# EAGLE design Zusatzprint_Raspberry_Pi_Zero (EAGLE 9.0.1)
DESIGNER: HOSA; VER: 1
Assembly variants: Standardbestückung, ohne HMI Channel 2, ohne HMI

## Sheet 1 of 3
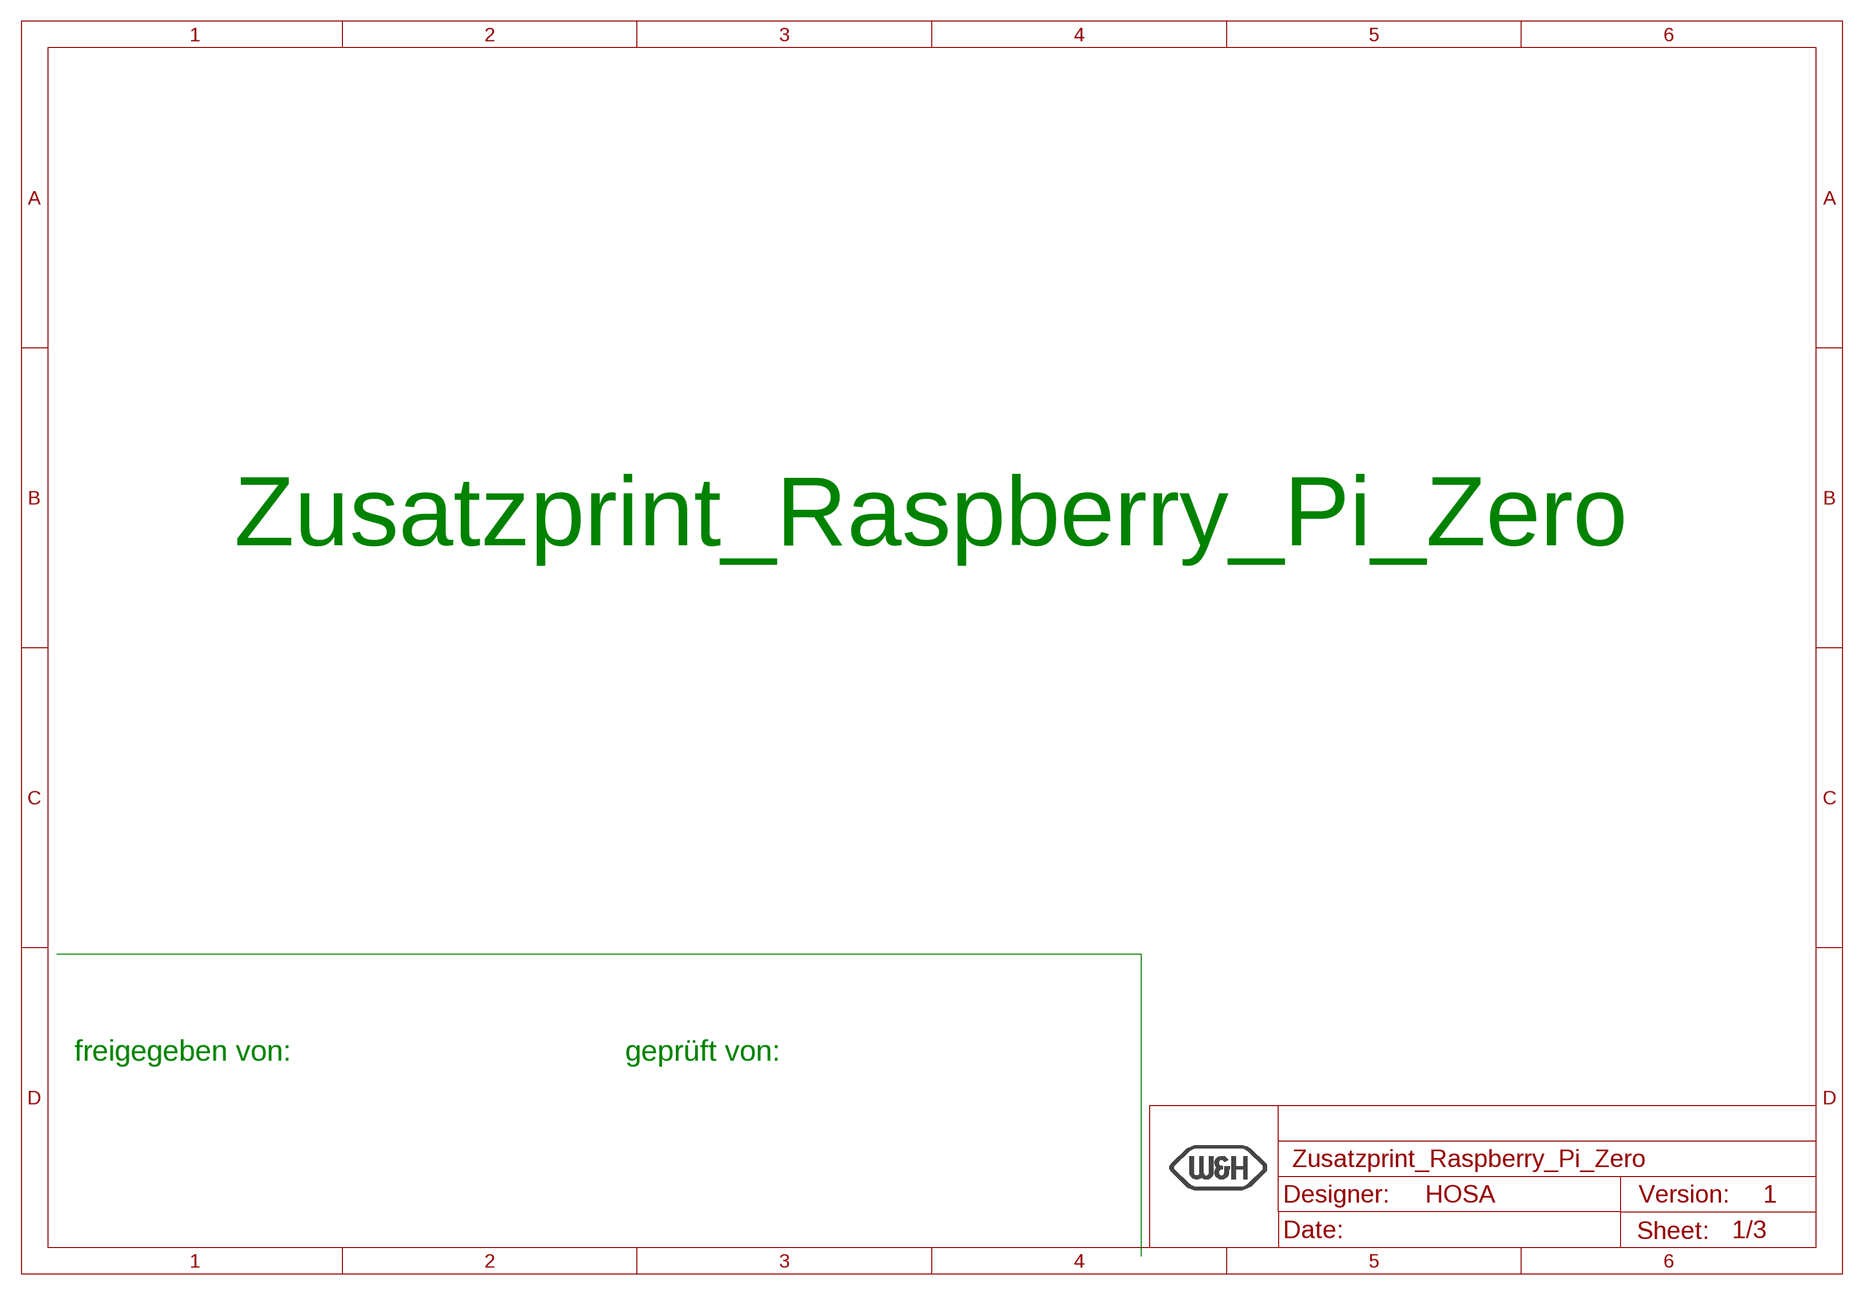
[diagram p0: schematic, sheet 1]
F1 (A4-QUERFORMAT): DESIGNER: HOSA; VER: 1

### Notes on the sheet
- Zusatzprint_Raspberry_Pi_Zero
- freigegeben von: | geprüft von:

## Sheet 2 of 3
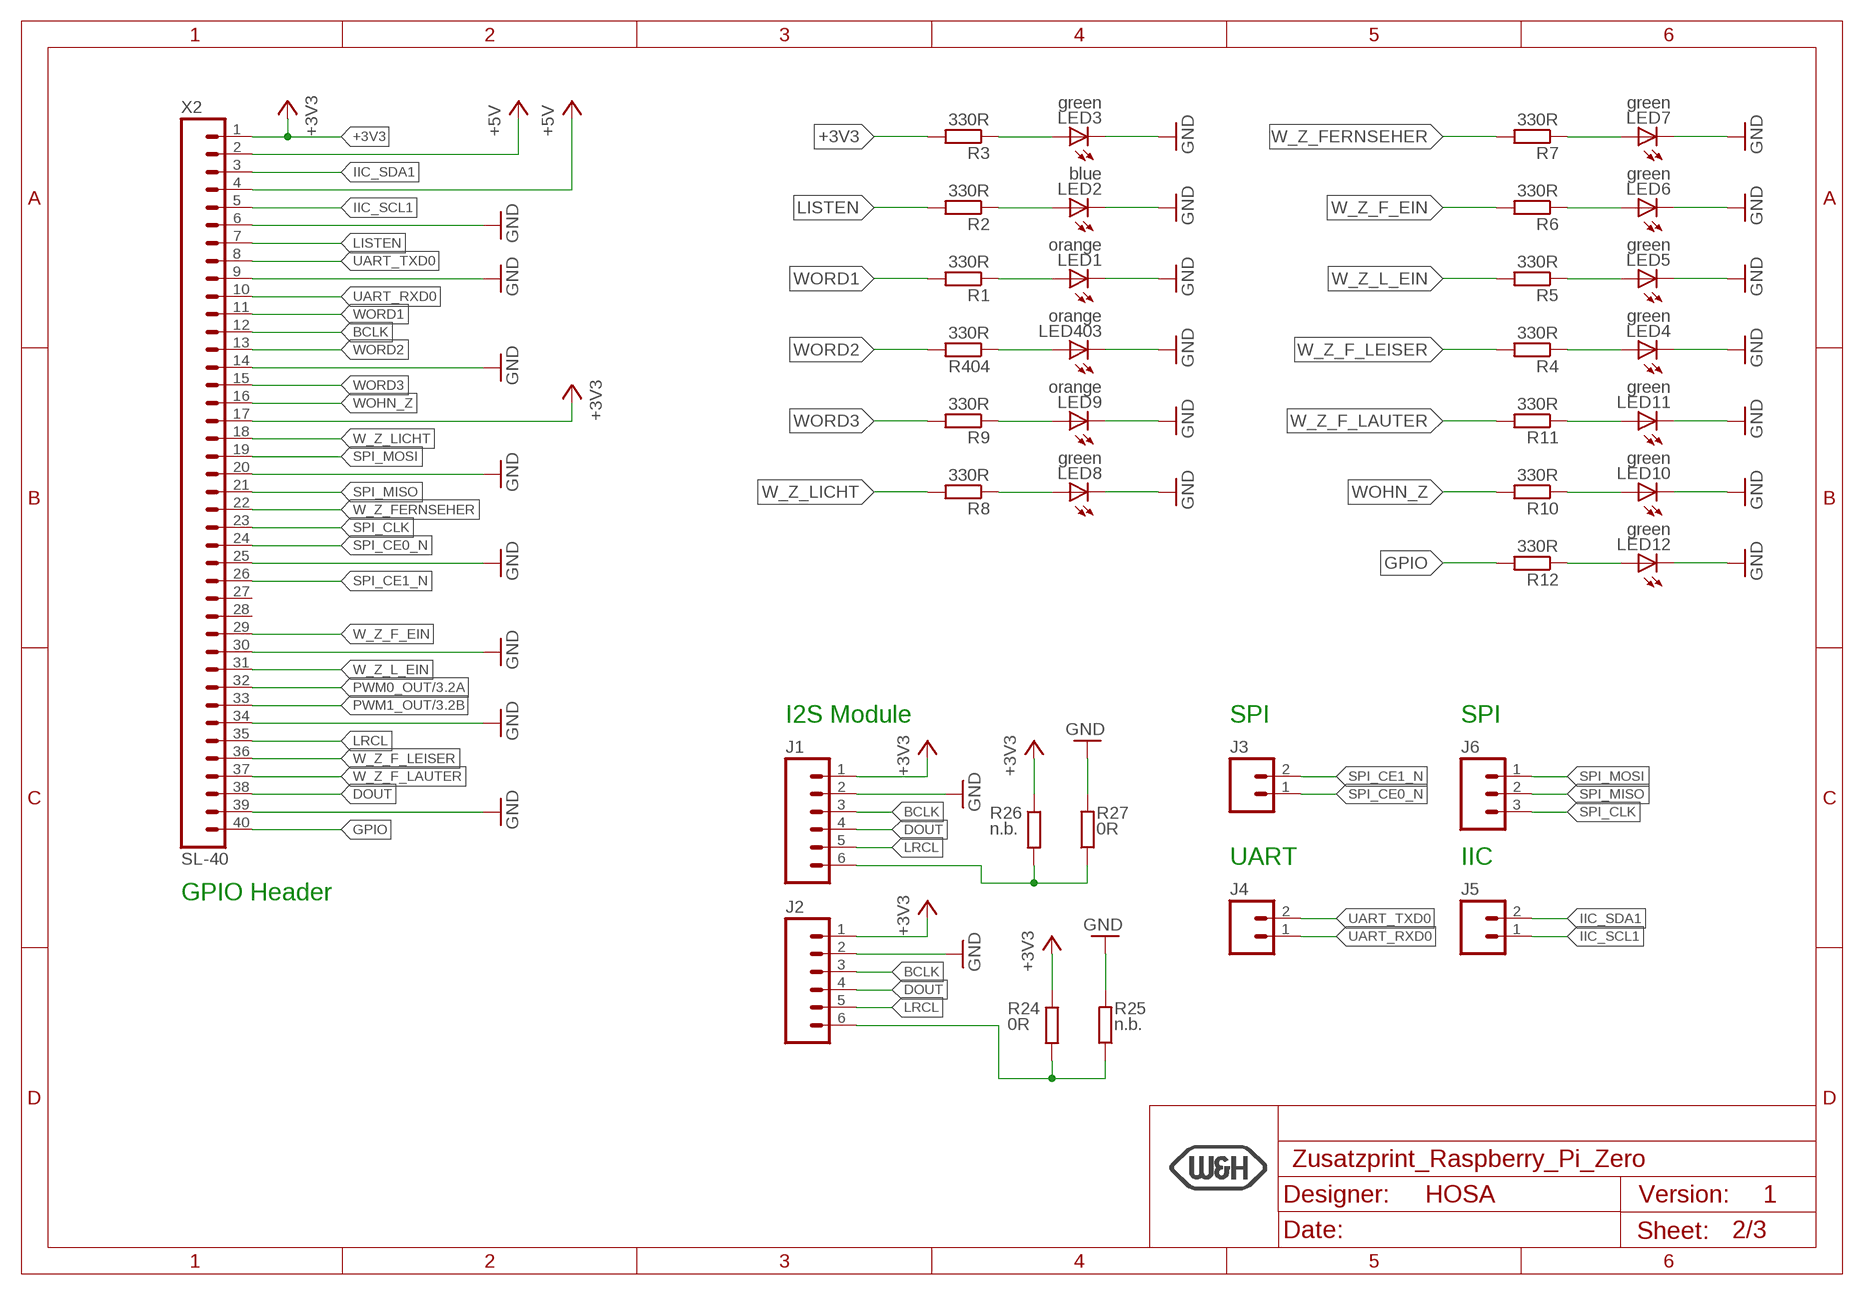
[diagram p1: schematic, sheet 2]
F2 (A4-QUERFORMAT): DESIGNER: HOSA; VER: 1

### Parts
J1  S-LEISTE-06  [BL-06]
J2  S-LEISTE-06  [BL-06]
J3  S-LEISTE-02  [BL-02]
J4  S-LEISTE-02  [BL-02]
J5  S-LEISTE-02  [BL-02]
J6  S-LEISTE-03  [BL-03]
LED1  orange  LEDCHIP-LED0805  [CHIP-LED0805]
LED2  blue  LEDCHIP-LED0805  [CHIP-LED0805]
LED3  green  LEDCHIP-LED0805  [CHIP-LED0805]
LED4  green  LEDCHIP-LED0805  [CHIP-LED0805]
LED5  green  LEDCHIP-LED0805  [CHIP-LED0805]
LED6  green  LEDCHIP-LED0805  [CHIP-LED0805]
LED7  green  LEDCHIP-LED0805  [CHIP-LED0805]
LED8  green  LEDCHIP-LED0805  [CHIP-LED0805]
LED9  orange  LEDCHIP-LED0805  [CHIP-LED0805]
LED10  green  LEDCHIP-LED0805  [CHIP-LED0805]
LED11  green  LEDCHIP-LED0805  [CHIP-LED0805]
LED12  green  LEDCHIP-LED0805  [CHIP-LED0805]
LED403  orange  LEDCHIP-LED0805  [CHIP-LED0805]
R1  330R  R-EU_M0805  [M0805]
R2  330R  R-EU_M0805  [M0805]
R3  330R  R-EU_M0805  [M0805]
R4  330R  R-EU_M0805  [M0805]
R5  330R  R-EU_M0805  [M0805]
R6  330R  R-EU_M0805  [M0805]
R7  330R  R-EU_M0805  [M0805]
R8  330R  R-EU_M0805  [M0805]
R9  330R  R-EU_M0805  [M0805]
R10  330R  R-EU_M0805  [M0805]
R11  330R  R-EU_M0805  [M0805]
R12  330R  R-EU_M0805  [M0805]
R24  0R  R-EU_M0805  [M0805]
R25  n.b.  R-EU_M0805  [M0805]
R26  n.b.  R-EU_M0805  [M0805]
R27  0R  R-EU_M0805  [M0805]
R404  330R  R-EU_M0805  [M0805]
X2  SL-40  [SL_40]

### Nets
+3V3: J1.1 J2.1 R3.2 R24.1 R26.1 X2.1 X2.17 ; also sheet 3
+5V: X2.2 X2.4
BCLK: J1.3 J2.3 X2.12
DOUT: J1.4 J2.4 X2.38
GND: J1.2 J2.2 LED1.C LED2.C LED3.C LED4.C LED5.C LED6.C LED7.C LED8.C LED9.C LED10.C LED11.C LED12.C LED403.C R25.2 R27.2 X2.6 X2.9 X2.14 X2.20 X2.25 X2.30 X2.34 X2.39 ; also sheet 3
GPIO: R12.2 X2.40
IIC_SCL1: J5.1 X2.5
IIC_SDA1: J5.2 X2.3
LISTEN: R2.2 X2.7
LRCL: J1.5 J2.5 X2.35
N$2: LED1.A R1.1
N$3: LED2.A R2.1
N$4: LED3.A R3.1
N$5: LED12.A R12.1
N$13: J2.6 R24.2 R25.1
N$15: J1.6 R26.2 R27.1
N$24: LED4.A R4.1
N$25: LED5.A R5.1
N$26: LED6.A R6.1
N$27: LED7.A R7.1
N$30: LED8.A R8.1
N$31: LED9.A R9.1
N$32: LED10.A R10.1
N$33: LED11.A R11.1
N$35: LED403.A R404.1
PWM0_OUT: X2.32 ; also sheet 3
PWM1_OUT: X2.33 ; also sheet 3
SPI_CE0_N: J3.1 X2.24
SPI_CE1_N: J3.2 X2.26
SPI_CLK: J6.3 X2.23
SPI_MISO: J6.2 X2.21
SPI_MOSI: J6.1 X2.19
UART_RXD0: J4.1 X2.10
UART_TXD0: J4.2 X2.8
W_Z_F_EIN: R6.2 X2.29
W_Z_F_LAUTER: R11.2 X2.37
W_Z_F_LEISER: R4.2 X2.36
W_Z_FERNSEHER: R7.2 X2.22
W_Z_L_EIN: R5.2 X2.31
W_Z_LICHT: R8.2 X2.18
WOHN_Z: R10.2 X2.16
WORD1: R1.2 X2.11
WORD2: R404.2 X2.13
WORD3: R9.2 X2.15
Unconnected: X2.27 X2.28

### Notes on the sheet
- I2S Module | SPI | SPI
- UART | IIC
- GPIO Header

## Sheet 3 of 3
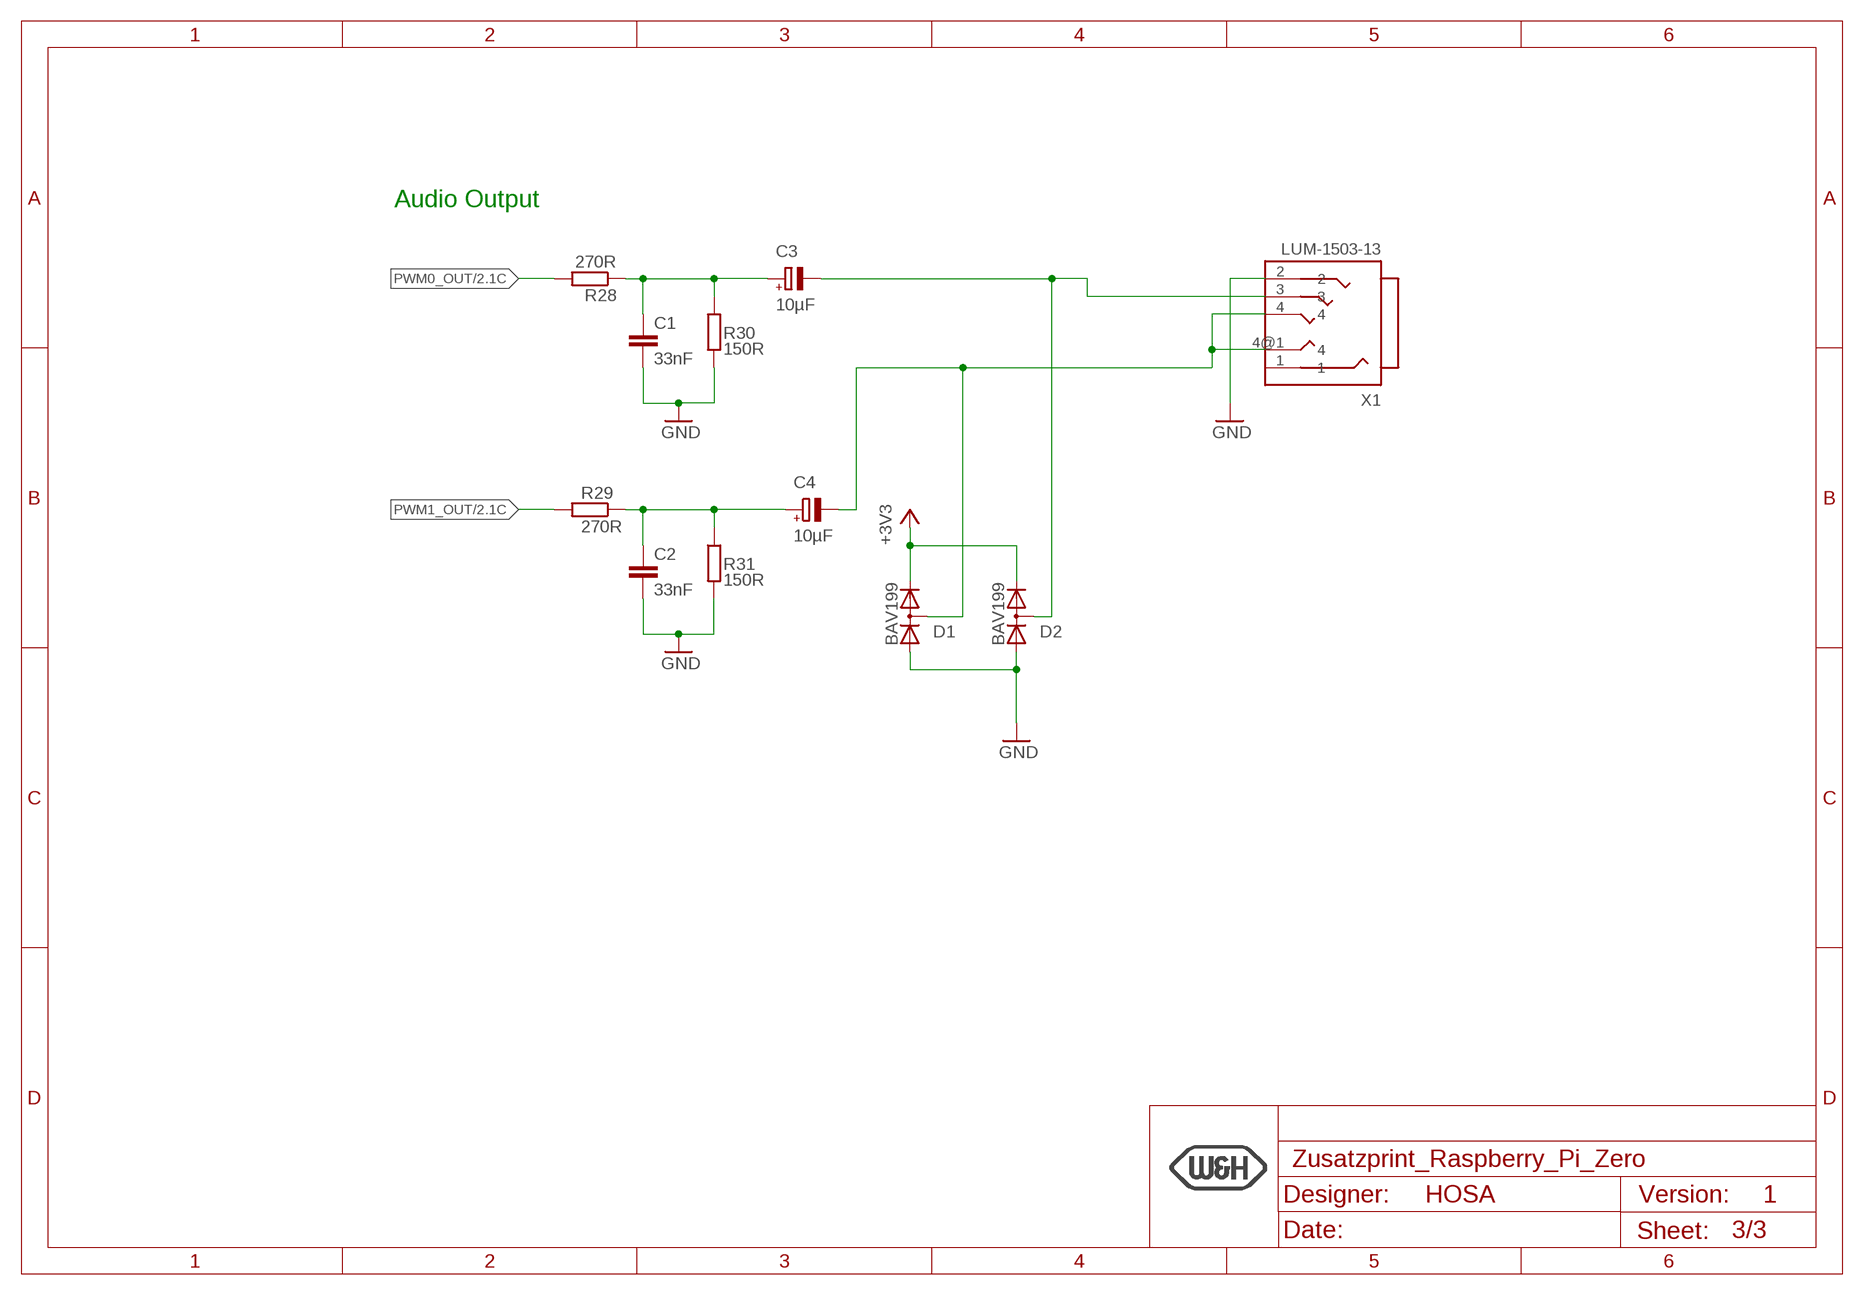
[diagram p2: schematic, sheet 3]
F3 (A4-QUERFORMAT): DESIGNER: HOSA; VER: 1

### Parts
C1  33nF  C-EUC0805  [C0805]
C2  33nF  C-EUC0805  [C0805]
C3  10µF  CPOL-EUE2.5-6  [E2,5-6]
C4  10µF  CPOL-EUE2.5-6  [E2,5-6]
D1  BAV199  [SOT23]
D2  BAV199  [SOT23]
R28  270R  R-EU_M0805  [M0805]
R29  270R  R-EU_M0805  [M0805]
R30  150R  R-EU_M0805  [M0805]
R31  150R  R-EU_M0805  [M0805]
X1  LUM-1503-13  [1503-13]

### Nets
+3V3: D1.2(C) D2.2(C) ; also sheet 2
GND: C1.2 C2.2 D1.1(A) D2.1(A) R30.2 R31.2 X1.2 ; also sheet 2
N$22: C1.1 C3.+ R28.1 R30.1
N$67: C2.1 C4.+ R29.1 R31.1
N$71: C4.- D1.3(AC) X1.4 X1.4@1
N$74: C3.- D2.3(AC) X1.3
PWM0_OUT: R28.2 ; also sheet 2
PWM1_OUT: R29.2 ; also sheet 2
Unconnected: X1.1

### Notes on the sheet
- Audio Output

## Library data of the parts
C1 C2 = rcl:C-EU: CAPACITOR, European symbol
C3 C4 = rcl:CPOL-EU: POLARIZED CAPACITOR, European symbol
D1 D2 = diode:BAV199: DIODE low-leakage double diode
J1 J2 = user_connector:*-LEISTE-06: Connector ; Stiftleilste 6 polig ; grid 2,54 mm
J3-J5 = user_connector:*-LEISTE-02: Connector ; Stiftleilste 2 polig ; grid 2,54 mm
J6 = user_connector:*-LEISTE-03: Connector ; Stiftleilste 3 polig ; grid 2,54 mm
LED1-LED12 LED403 = led:LED: LED OSRAM: - CHIPLED LG R971, LG N971, LY N971, LG Q971, LY Q971, LO R971, LY R971 LH N974, LH R974 LS Q976, LO Q976, LY Q976 LO Q996 - Hyper CHIPLED LW Q18S LB Q993, LB Q99A, LB R99A - SideLED LS A670, LO A670, LY A670, LG A670, LP A670 LB A673, LV A673, LT A673, LW A673 LH A674 LY A675 LS A676, LA A676, LO A676, LY A676, LW A676 LS A679, LY A679, LG A679 - Hyper Micro SIDELED® LS Y876, LA Y876, LO Y876, LY Y876 LT Y87S - SmartLED LW L88C, LW L88S LB L89C, LB L89S, LG L890 LS L89K, LO L89K, LY L89K LS L896, LA L896, LO L896, LY L896 - TOPLED LS T670, LO T670, LY T670, LG T670, LP T670 LSG T670, LSP T670, LSY T670, LOP T670, LYG T670 LG T671, LOG T671, LSG T671 LB T673, LV T673, LT T673, LW T673 LH T674 LS T676, LA T676, LO T676, LY T676, LB T676, LH T676, LSB T676, LW T676 LB T67C, LV T67C, LT T67C, LS T67K, LO T67K, LY T67K, LW E67C LS E67B, LA E67B, LO E67B, LY E67B, LB E67C, LV E67C, LT E67C LW T67C LS T679, LY T679, LG T679 LS T770, LO T770, LY T770, LG T770, LP T770 LB T773, LV T773, LT T773, LW T773 LH T774 LS E675, LA E675, LY E675, LS T675 LS T776, LA T776, LO T776, LY T776, LB T776 LHGB T686 LT T68C, LB T68C - Hyper Mini TOPLED® LB M676 - Mini TOPLED Santana® LG M470 LS M47K, LO M47K, LY M47K Source: http://www.osram.convergy.de LUXEON: - LUMILED® LXK2-PW12-R00, LXK2-PW12-S00, LXK2-PW14-U00, LXK2-PW14-V00 LXK2-PM12-R00, LXK2-PM12-S00, LXK2-PM14-U00 LXK2-PE12-Q00, LXK2-PE12-R00, LXK2-PE12-S00, LXK2-PE14-T00, LXK2-PE14-U00 LXK2-PB12-K00, LXK2-PB12-L00, LXK2-PB12-M00, LXK2-PB14-N00, LXK2-PB14-P00, LXK2-PB14-Q00 LXK2-PR12-L00, LXK2-PR12-M00, LXK2-PR14-Q00, LXK2-PR14-R00 LXK2-PD12-Q00, LXK2-PD12-R00, LXK2-PD12-S00 LXK2-PH12-R00, LXK2-PH12-S00 LXK2-PL12-P00, LXK2-PL12-Q00, LXK2-PL12-R00 Source: www.luxeon.com KINGBRIGHT: KA-3528ASYC Source: www.kingbright.com
R1-R12 R24-R31 R404 = rcl:R-EU_: RESISTOR, European symbol
X1 = user_connector-SRA:LUM-1503-13: Klinkenbuchse 4polig, THT, IPX7 Features: Technische Daten Bezeichnung Nennspannung Nennstrom Steckzyklen Ziehkraft Steckkraft Prüfspg. 1503-13 12V DC 1 A 5.000 4,9-24,5N 3,9-14,7N 500V / 60s Mechanische Daten Isolierstoff Kontaktmaterial Kontaktbeschichtung Temperaturbereich Höhe PAPA 66GF, V0 nach UL94 Cu-Legierung versilbert -20 .. 70 °C 6mm Bestellung Lieferant Bestellnummer Preis Hersteller Herstellernr. Farnell 1368640 0,85€/Stk (@500K) 1,18€/Stk (10 Stk) Lumberg 1503 13; MF: Lumberg; MPN: 1503 13; OC_FARNELL: 1368640
X2 = user_connector_HOSA:SL-40

## Board
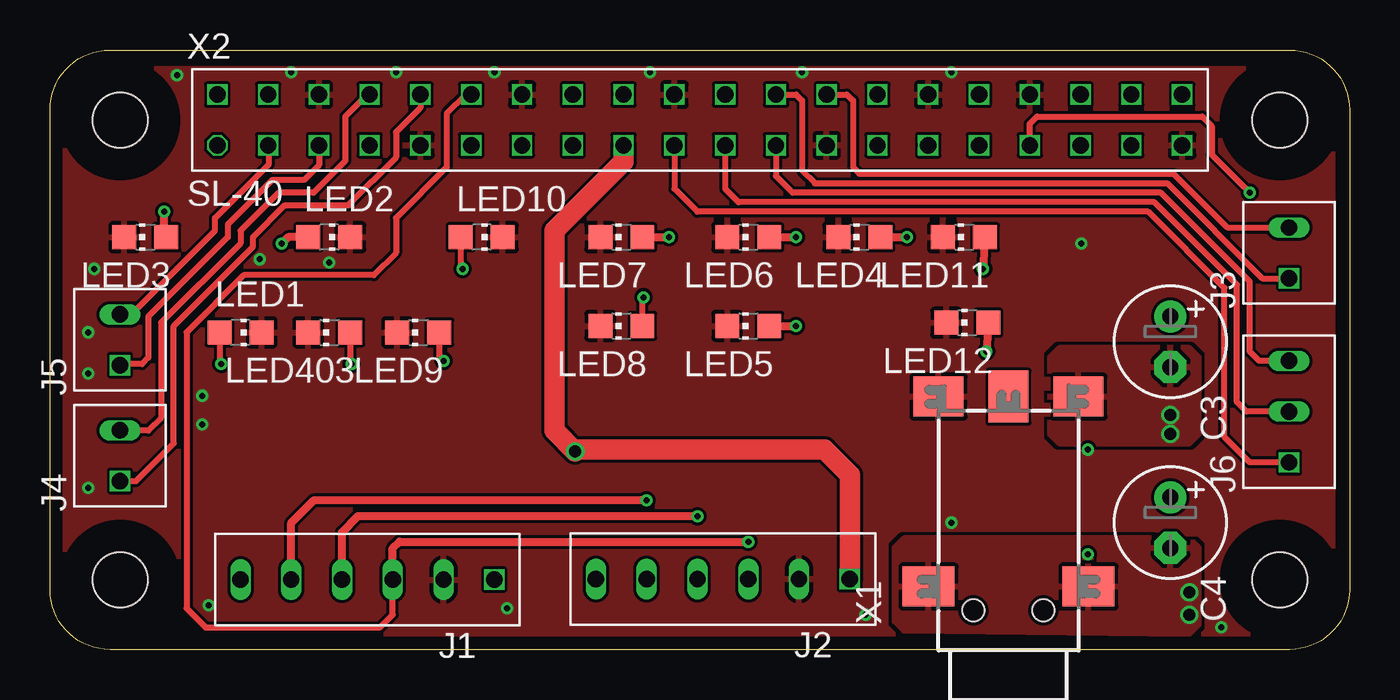
[diagram p3: board, top side]
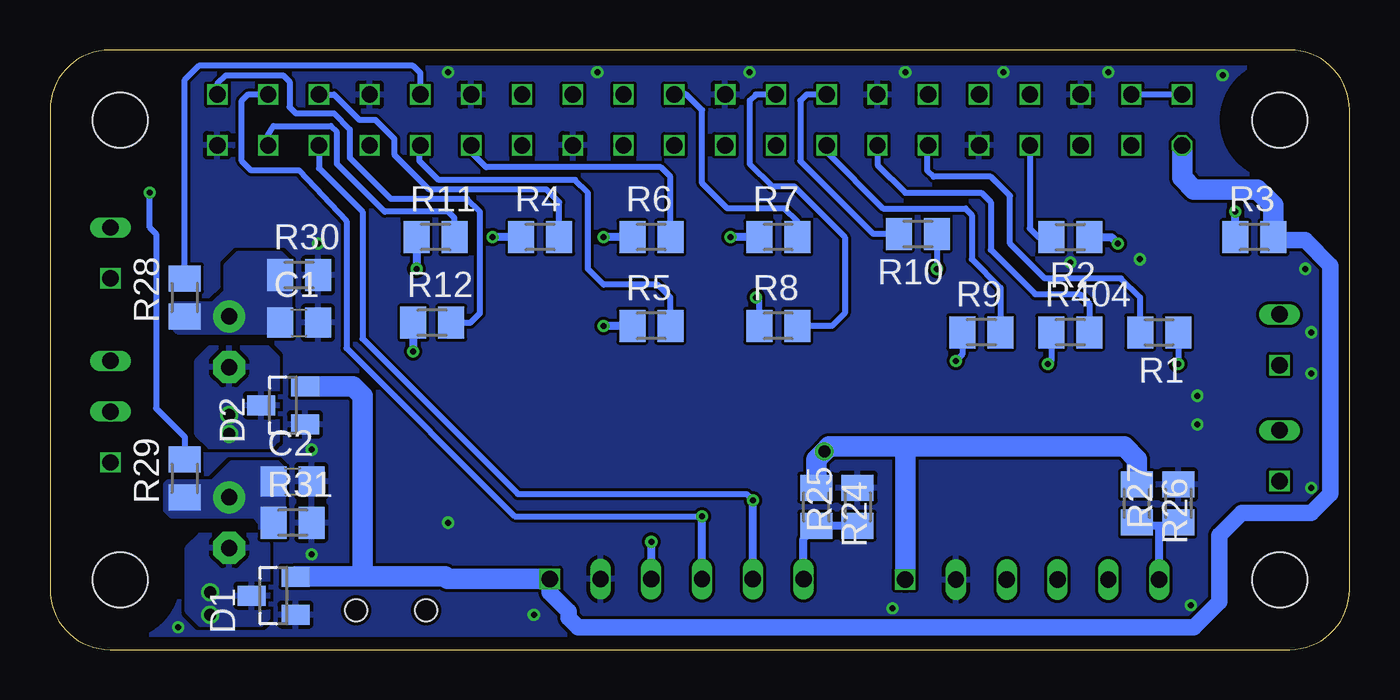
[diagram p4: board, bottom side, seen from below]

Size 65 x 30 mm. Coordinates in mm from the lower left corner, seen from the top.
Outline: 65,27 65,3 arc-90 62,0 3,0 arc-90 0,3 0,27 arc-90 3,30 62,30 arc-90 65,27
Copper layers ([2:1+(2*15)+16:15]): Top 0.035mm / dielectric 0.22mm / Route2 0.035mm / dielectric 1mm / Route15 0.035mm / dielectric 0.22mm / Bottom 0.035mm
Design rules "CONTEC-035um-CU_4Layer_OhneRasterWinkelPrüfung *": minimum track width 6mil, minimum drill 0.3mm, track to track 6mil, track to pad 6mil, pad to pad 6mil, via to via 6mil, smd to smd 6mil, copper to edge 0.2mm, drill to drill 8mil, minimum pad ring 4mil, minimum via ring 6mil, stop-mask expansion 0mil, vias tented up to drill 0mil, thermal gap 8mil
Holes 2.75 mm at 3.5,3.5 3.5,26.5 61.5,26.5 61.5,3.5
tKeepout: area 0.5,23.5 to 6.5,29.5; area 58.5,23.5 to 64.5,29.5; area 0.5,0.5 to 6.5,6.5; area 58.5,0.5 to 64.5,6.5; area 7.6,1.3 to 24.3,14; area 25.4,1.3 to 42.1,14
bKeepout: area 0.5,23.5 to 6.5,29.5; area 0.5,0.5 to 6.5,6.5; area 58.5,23.5 to 64.5,29.5; area 58.5,0.5 to 64.5,6.5
tRestrict: area 0.5,23.5 to 6.5,29.5; area 58.5,23.5 to 64.5,29.5; area 0.5,0.5 to 6.5,6.5; area 58.5,0.5 to 64.5,6.5; 8 lines
bRestrict: area 0.5,23.5 to 6.5,29.5; area 0.5,0.5 to 6.5,6.5; area 58.5,23.5 to 64.5,29.5; area 58.5,0.5 to 64.5,6.5; 8 lines

### Footprints (pad centres in the part's own frame; a part is rotated, then mirrored left to right if it is on the bottom)
C0805 = smd 1.3 x 1.5: 1 -0.95,0; 2 0.95,0
E2,5-6 = drill 0.813 pad 1.6: + -1.27,0 | drill 0.813 pad 1.6 octagon: - 1.27,0
SOT23 = smd 1 x 1.4: 1 -0.95,-1.1; 2 0.95,-1.1; 3 0,1.1
BL-06 = drill 0.813 square: 1 -6.35,0 | drill 0.813 long: 2 -3.81,0; 3 -1.27,0; 4 1.27,0; 5 3.81,0; 6 6.35,0
BL-02 = drill 0.813 square: 1 -1.27,0 | drill 0.813 long: 2 1.27,0
BL-03 = drill 0.813 square: 1 -2.54,0 | drill 0.813 long: 2 0,0; 3 2.54,0
CHIP-LED0805 = smd 1.2 x 1.2: A 0,-1.05; C 0,1.05
M0805 = smd 1.3 x 1.6: 1 -0.95,0; 2 0.95,0
1503-13 = smd 2.6 x 2: 1 15.2,0 | smd 2 x 2.5: 2 15.2,3.5; 3 15.2,-3.5 | smd 2 x 2.6: 4 5.7,-4; 4@1 5.7,4 | hole 1.1: 4.5,1.75; 4.5,-1.75
SL_40 = drill 0.813 octagon: 1 -24.13,-1.27 | drill 0.813 square: 2 -24.13,1.27; 3 -21.59,-1.27; 4 -21.59,1.27; 5 -19.05,-1.27; 6 -19.05,1.27; 7 -16.51,-1.27; 8 -16.51,1.27; 9 -13.97,-1.27; 10 -13.97,1.27; 11 -11.43,-1.27; 12 -11.43,1.27; 13 -8.89,-1.27; 14 -8.89,1.27; 15 -6.35,-1.27; 16 -6.35,1.27; 17 -3.81,-1.27; 18 -3.81,1.27; 19 -1.27,-1.27; 20 -1.27,1.27; 21 1.27,-1.27; 22 1.27,1.27; 23 3.81,-1.27; 24 3.81,1.27; 25 6.35,-1.27; 26 6.35,1.27; 27 8.89,-1.27; 28 8.89,1.27; 29 11.43,-1.27; 30 11.43,1.27; 31 13.97,-1.27; 32 13.97,1.27; 33 16.51,-1.27; 34 16.51,1.27; 35 19.05,-1.27; 36 19.05,1.27; 37 21.59,-1.27; 38 21.59,1.27; 39 24.13,-1.27; 40 24.13,1.27

### Placement (x,y rotation side)
C1  52.55,16.35 0 bottom
C2  52.86,8.41 0 bottom
C3  56.04,15.4 270 top
C4  56.04,6.35 270 top
D1  53.82,2.7 90 bottom
D2  53.34,12.22 90 bottom
J1  15.88,3.5 180 top
J2  33.66,3.53 180 top
J3  61.98,19.84 90 top
J4  3.5,9.7 90 top
J5  3.5,15.5 90 top
J6  61.98,11.91 90 top
LED1  9.53,15.88 270 top
LED2  13.97,20.64 270 top
LED3  4.76,20.64 90 top
LED4  40.48,20.64 90 top
LED5  34.92,16.19 90 top
LED6  34.92,20.64 90 top
LED7  28.57,20.64 90 top
LED8  28.57,16.19 90 top
LED9  18.41,15.88 90 top
LED10  21.59,20.64 270 top
LED11  45.72,20.64 90 top
LED12  45.88,16.35 90 top
LED403  13.97,15.88 90 top
R1  9.53,15.88 180 bottom
R2  13.97,20.64 180 bottom
R3  4.76,20.64 0 bottom
R4  40.48,20.64 0 bottom
R5  34.92,16.19 0 bottom
R6  34.92,20.64 0 bottom
R7  28.57,20.64 0 bottom
R8  28.57,16.19 0 bottom
R9  18.41,15.88 0 bottom
R10  21.59,20.8 180 bottom
R11  45.72,20.64 0 bottom
R12  45.88,16.35 0 bottom
R24  26.67,7.14 270 bottom
R25  24.61,7.14 90 bottom
R26  10.64,7.3 270 bottom
R27  8.57,7.3 90 bottom
R28  58.26,17.62 90 bottom
R29  58.26,8.57 90 bottom
R30  52.55,18.73 0 bottom
R31  52.86,6.35 0 bottom
R404  13.97,15.88 0 bottom
X1  47.94,-2.54 90 top
X2  32.5,26.5 0 top

### Tracks (layer width: path | path; a pad name or v marks a point on that pad's centre or on a via)
+3V3  (via drill 0.6)
  Top 1.016: J2.1 40.01,8.73 38.73,10 26.35,10 v26.27,9.92 25.24,10.95 25.24,20.95 28.69,24.4 X2.17
  Bottom 0.406: R3.2
  Bottom 0.813: J2.1 40.01,2.86 39.05,1.91 39.05,1.59 38.58,1.11 7.78,1.11 6.51,2.38 6.51,5.71 5.4,6.83 1.91,6.83 0.95,7.78 0.95,19.21 2.22,20.48 3.65,20.48 R3.2
  Bottom 1.016: X2.1 8.37,23.61 7.78,23.02 4.6,23.02 3.81,22.23 R3.2 | R26.1 10.64,9.53 11.27,10.16 22.07,10.16 | 22.07,10.16 26.04,10.16 v26.27,9.92 26.67,9.53 R24.1 | J1.1 22.23,10 22.07,10.16 | J2.1 45.12,3.53 45.24,3.65 49.37,3.65 | 49.37,3.65 D1.2 | D2.2 49.84,13.17 49.37,12.7 49.37,3.65
+5V
  Bottom 0.305: X2.2 X2.4
BCLK  (via drill 0.3)
  Top 0.305: X2.12 20.79,27.77 19.84,26.83 19.84,24.13 17.3,21.59 17.3,19.84 16.19,18.73 9.68,18.73 6.83,15.88 6.83,2.06 7.78,1.11 16.51,1.11 17.14,1.75 J1.3
  Top 0.406: v34.92,5.4 17.46,5.4 17.14,5.08 J1.3
  Bottom 0.406: J2.3 v34.92,5.4
DOUT  (via drill 0.3)
  Top 0.406: J1.4 14.61,5.87 15.4,6.67 v32.38,6.67
  Bottom 0.305: v32.38,6.67 41.75,6.67 50.16,15.08 50.16,21.43 52.55,23.97 54.93,23.97 55.4,24.45 55.4,27.46 55.09,27.78 X2.38
  Bottom 0.406: J2.4 v32.38,6.67
GND  (via drill 0.3)
  other vias: 2.22,19.05 6.35,28.73 1.91,15.88 1.91,13.81 1.91,8.1 7.94,2.22 22.86,2.06 40.8,1.75 58.58,1.11 12.06,28.89 17.3,28.89 22.23,28.89 30,28.89 37.62,28.89 45.09,28.89 51.59,20.32 10.48,19.53 51.91,4.76 45.09,6.35 51.91,10 13.97,19.37 7.62,11.27 7.62,12.7
  pour Bottom (rank 6): 6.99,29.05 62.55,29.05 64.14,27.46 64.14,3.81 64.14,3.17 62.07,1.11 61.75,0.79 2.86,0.79 0.79,2.86 0.79,26.83 3.02,29.05
  pour Top (rank 6): 6.99,29.05 62.55,29.05 64.14,27.46 64.14,3.81 64.14,3.17 62.07,1.11 61.75,0.79 2.86,0.79 0.79,2.86 0.79,26.83 3.02,29.05
GPIO
  Bottom 0.305: X2.40 56.63,28.3 56.2,28.73 53.34,28.73 53.02,28.42 53.02,27.15 52.7,26.83 50.8,26.83 50.01,26.04 50.01,24.61 47.94,22.54 44.13,22.54 43.5,21.91 43.5,16.83 43.97,16.35 R12.2
IIC_SCL1
  Top 0.305: X2.5 13.45,24.25 12.7,23.5 11.11,23.5 8.89,21.27 8.89,20.64 4.92,16.67 4.92,14.61 4.6,14.29 3.56,14.29 J5.1
IIC_SDA1
  Top 0.305: X2.3 10.95,25.19 10.95,24.29 8.26,21.59 8.26,20.95 4.13,16.83 3.56,16.83 J5.2
LISTEN
  Bottom 0.305: X2.7 15.99,21.07 15.56,20.64 R2.2
LRCL  (via drill 0.3)
  Top 0.406: J1.5 12.06,6.35 13.18,7.46 v29.84,7.46
  Bottom 0.305: X2.35 51.55,24.09 49.37,21.91 49.37,15.56 41.59,7.78 30.16,7.78 v29.84,7.46
  Bottom 0.406: J2.5 v29.84,7.46
N$2  (via drill 0.3)
  Top 0.305: LED1.A 8.47,14.38 v8.57,14.29
  Bottom 0.305: R1.1 v8.57,14.29
N$3  (via drill 0.3)
  Top 0.406: LED2.A 11.91,20.64 v11.59,20.32
  Bottom 0.406: R2.1 11.91,20.64 v11.59,20.32
N$4  (via drill 0.3)
  Top 0.406: LED3.A R3.1 v5.71,21.91
  Bottom 0.406: R3.1 v5.71,21.91
N$5  (via drill 0.3)
  Top 0.406: LED12.A v46.83,14.92
  Bottom 0.406: R12.1 v46.83,14.92
N$13
  Bottom 0.406: R25.1 R24.2 27.3,5.56 J2.6
N$15
  Bottom 0.406: R27.1 8.73,6.19 9.37,6.19 | 9.37,6.19 10.47,6.19 R26.2 | J1.6 9.53,6.03 9.37,6.19
N$22
  pour Bottom (rank 2, no thermals): 53.02,19.37 53.02,16.19 53.34,15.88 58.58,15.88 58.9,16.19 58.9,17.14 58.74,17.3 56.83,17.3 56.2,17.94 56.2,19.21 55.56,19.84 53.5,19.84
N$24  (via drill 0.3)
  Top 0.406: LED4.A v42.86,20.64
  Bottom 0.406: R4.1 v42.86,20.64
N$25  (via drill 0.3)
  Top 0.406: LED5.A v37.31,16.19
  Bottom 0.406: R5.1 v37.31,16.19
N$26  (via drill 0.3)
  Top 0.406: LED6.A v37.31,20.64
  Bottom 0.406: R6.1 v37.31,20.64
N$27  (via drill 0.3)
  Top 0.406: LED7.A v30.96,20.64
  Bottom 0.406: R7.1 v30.96,20.64
N$30  (via drill 0.3)
  Top 0.305: LED8.A 29.62,17.56 v29.69,17.62
  Bottom 0.305: R8.1 29.52,17.46 v29.69,17.62
N$31  (via drill 0.3)
  Top 0.305: LED9.A 19.46,14.67 v19.68,14.45
  Bottom 0.305: R9.1 19.36,14.77 v19.68,14.45
N$32  (via drill 0.3)
  Top 0.305: LED10.A 20.54,19.15 v20.64,19.05
  Bottom 0.305: R10.1 v20.64,19.05
N$33  (via drill 0.3)
  Top 0.406: LED11.A v46.67,19.05
  Bottom 0.406: R11.1 v46.67,19.05
N$35  (via drill 0.3)
  Top 0.305: LED403.A 15.02,14.35 v15.08,14.29
  Bottom 0.305: R404.1 14.92,14.45 v15.08,14.29
N$67
  pour Bottom (rank 3, no thermals): 53.34,9.05 53.34,5.87 53.5,5.71 54.29,5.71 54.45,5.87 54.45,6.35 54.77,6.67 58.9,6.67 59.21,6.99 59.21,8.26 59.05,8.41 56.83,8.41 56.36,8.89 55.88,9.37 53.66,9.37
N$71  (via drill 0.6)
  other vias: 56.99,2.86 56.99,1.75
  pour Top: 42.23,5.08 42.23,1.43 42.7,0.95 56.99,0.79 57.47,1.27 57.47,5.08 56.99,5.56 42.7,5.56
  pour Bottom: 54.13,5.24 54.13,1.59 54.45,1.27 57.47,1.27 58.1,1.91 58.1,5.08 57.47,5.71 54.61,5.71
N$74  (via drill 0.6)
  other vias: 56.04,11.75 56.04,10.79
  pour Top: 50.01,14.61 50.01,10.79 50.48,10.32 56.99,10.32 57.47,10.79 57.47,14.61 56.99,15.08 50.48,15.08
  pour Bottom: 53.66,12.86 53.66,10.48 53.98,10.16 56.99,10.16 57.63,10.79 57.63,14.45 56.99,15.08 54.13,15.08 53.66,14.61
PWM0_OUT
  Bottom 0.305: X2.32 46.47,28.85 46.83,29.21 57.56,29.21 58.26,28.5 R28.2
PWM1_OUT  (via drill 0.3)
  Top 0.305: v60.01,22.86 58.1,24.77 58.1,26.19 57.63,26.67 49.37,26.67 49.01,26.31 X2.33
  Bottom 0.305: R29.2 58.26,10.64 59.69,12.06 59.69,20.8 60.01,21.11 v60.01,22.86
SPI_CE0_N
  Top 0.305: X2.24 37.32,27.77 37.62,27.46 37.62,23.97 38.26,23.34 55.88,23.34 60.64,18.57 J3.1
SPI_CE1_N
  Top 0.305: X2.26 39.86,27.77 40.16,27.46 40.16,24.13 40.48,23.81 56.2,23.81 58.9,21.11 J3.2
SPI_CLK
  Top 0.305: X2.23 36.31,23.7 37.15,22.86 55.56,22.86 60.01,18.41 60.01,14.92 60.48,14.45 J6.3
SPI_MISO
  Top 0.305: X2.21 33.77,23.06 34.45,22.38 55.24,22.38 59.37,18.26 59.37,12.38 59.85,11.91 J6.2
SPI_MOSI
  Top 0.305: X2.19 31.23,23.06 32.38,21.91 54.93,21.91 58.74,18.1 58.74,10.64 60.01,9.37 J6.1
UART_RXD0
  Top 0.305: X2.10 18.53,27.1 17.3,25.88 17.3,24.61 14.92,22.23 11.75,22.23 10.16,20.64 10.16,20.16 6.19,16.19 6.19,10.32 4.3,8.43 J4.1
UART_TXD0
  Top 0.305: X2.8 15.86,27.77 14.76,26.67 14.76,24.45 13.18,22.86 11.43,22.86 9.53,20.95 9.53,20.32 5.56,16.35 5.56,11.59 4.92,10.95 3.52,10.95 J4.2
W_Z_F_EIN
  Bottom 0.305: R6.2 33.98,23.66 34.45,24.13 43.18,24.13 43.97,24.92 43.97,25.19 X2.29
W_Z_F_LAUTER
  Bottom 0.305: X2.37 54.09,25.76 53.82,26.19 50.96,26.19 50.64,25.88 50.64,24.29 48.26,21.91 45.09,21.91 44.77,21.59 R11.2
W_Z_F_LEISER
  Bottom 0.305: R4.2 39.53,22.39 40.16,23.02 46.04,23.02 47.78,24.77 47.78,25.56 48.74,26.51 49.53,26.51 50.79,27.77 X2.36
W_Z_FERNSEHER
  Bottom 0.305: R7.2 27.62,21.43 28.26,22.07 31.11,22.07 32.38,23.34 32.38,26.99 33.18,27.78 X2.22
W_Z_L_EIN
  Bottom 0.305: R5.2 33.98,17.62 34.61,18.26 37.31,18.26 38.1,19.05 38.1,22.86 38.73,23.5 45.56,23.5 46.51,24.45 46.51,25.19 X2.31
W_Z_LICHT
  Bottom 0.305: X2.18 29.7,27.77 30,27.46 30,24.29 28.89,23.18 27.78,23.18 25.24,20.64 25.24,16.83 25.88,16.19 R8.2
WOHN_Z
  Bottom 0.305: X2.16 27.16,27.77 27.46,27.46 27.46,24.45 23.81,20.8 R10.2
WORD1
  Bottom 0.305: R1.2 10.47,17.62 11.43,18.57 15.24,18.57 16.99,20.32 16.99,22.7 17.94,23.65 20.8,23.65 21.11,23.97 21.11,25.19
  Bottom 0.406: 21.11,25.19 X2.11
WORD2
  Bottom 0.305: X2.13 23.61,24.25 22.23,22.86 18.41,22.86 17.94,22.38 17.94,20 15.72,17.78 13.49,17.78 13.02,17.3 R404.2
  Bottom 0.406: R404.2
WORD3
  Bottom 0.305: R9.2 17.46,18.1 18.89,19.53 18.89,21.75 19.21,22.07 23.34,22.07 26.15,24.88 X2.15
  Bottom 0.406: R9.2

### Text on the board
tStop: Power | Listen | Wohnzimmer | Fernseher | EIN | LEISER | LAUTER | Reserve | WORD1 | WORD2 | WORD3 | Licht | EIN